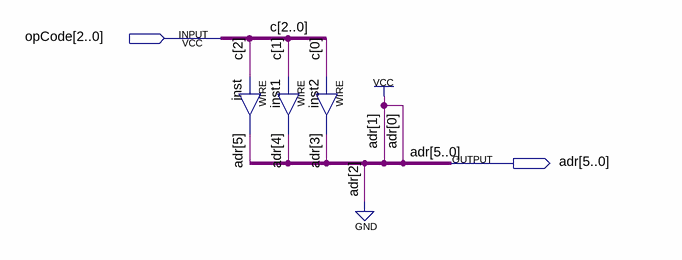
[diagram p0: schematic sheet]
// Quartus schematic DECODER.bdf as structural Verilog: 3 symbols, 2 pins
module DECODER (
  input  [2:0] opCode,
  output [5:0] adr
);

  assign adr[5] = opCode[2];  // WIRE inst
  assign adr[4] = opCode[1];  // WIRE inst1
  assign adr[3] = opCode[0];  // WIRE inst2

  assign adr[2:0] = 3'b011;

  // Other names for the same wires on the sheet: c[2:0] = opCode
endmodule
